# EAGLE design 14pole (EAGLE 8.3.2)
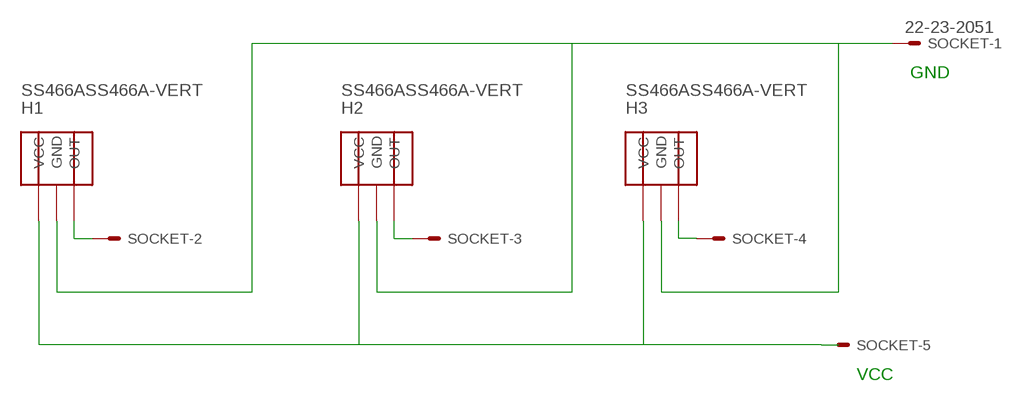
[diagram p0: schematic, sheet 1]

## Parts
H1  SS466ASS466A-VERT  [SS466A]
H2  SS466ASS466A-VERT  [SS466A]
H3  SS466ASS466A-VERT  [SS466A]
SOCKET  22-23-2051  [22-23-2051]

## Nets
N$1: H1.GND H2.GND H3.GND SOCKET.1
N$2: H1.VCC H2.VCC H3.VCC SOCKET.5
N$5: H3.OUT SOCKET.4
N$6: H2.OUT SOCKET.3
N$7: H1.OUT SOCKET.2

## Notes on the sheet
- GND
- VCC

## Library data of the parts
H1-H3 = SS466A:SS466A; SS466A: 0
SOCKET = con-molex:22-23-2051: .100" (2.54mm) Center Header - 5 Pin; MF: MOLEX; MPN: 22-23-2051; OC_FARNELL: 1462952; OC_NEWARK: 38C9178

## Net classes
0 default: width 0.762 mm

## Board
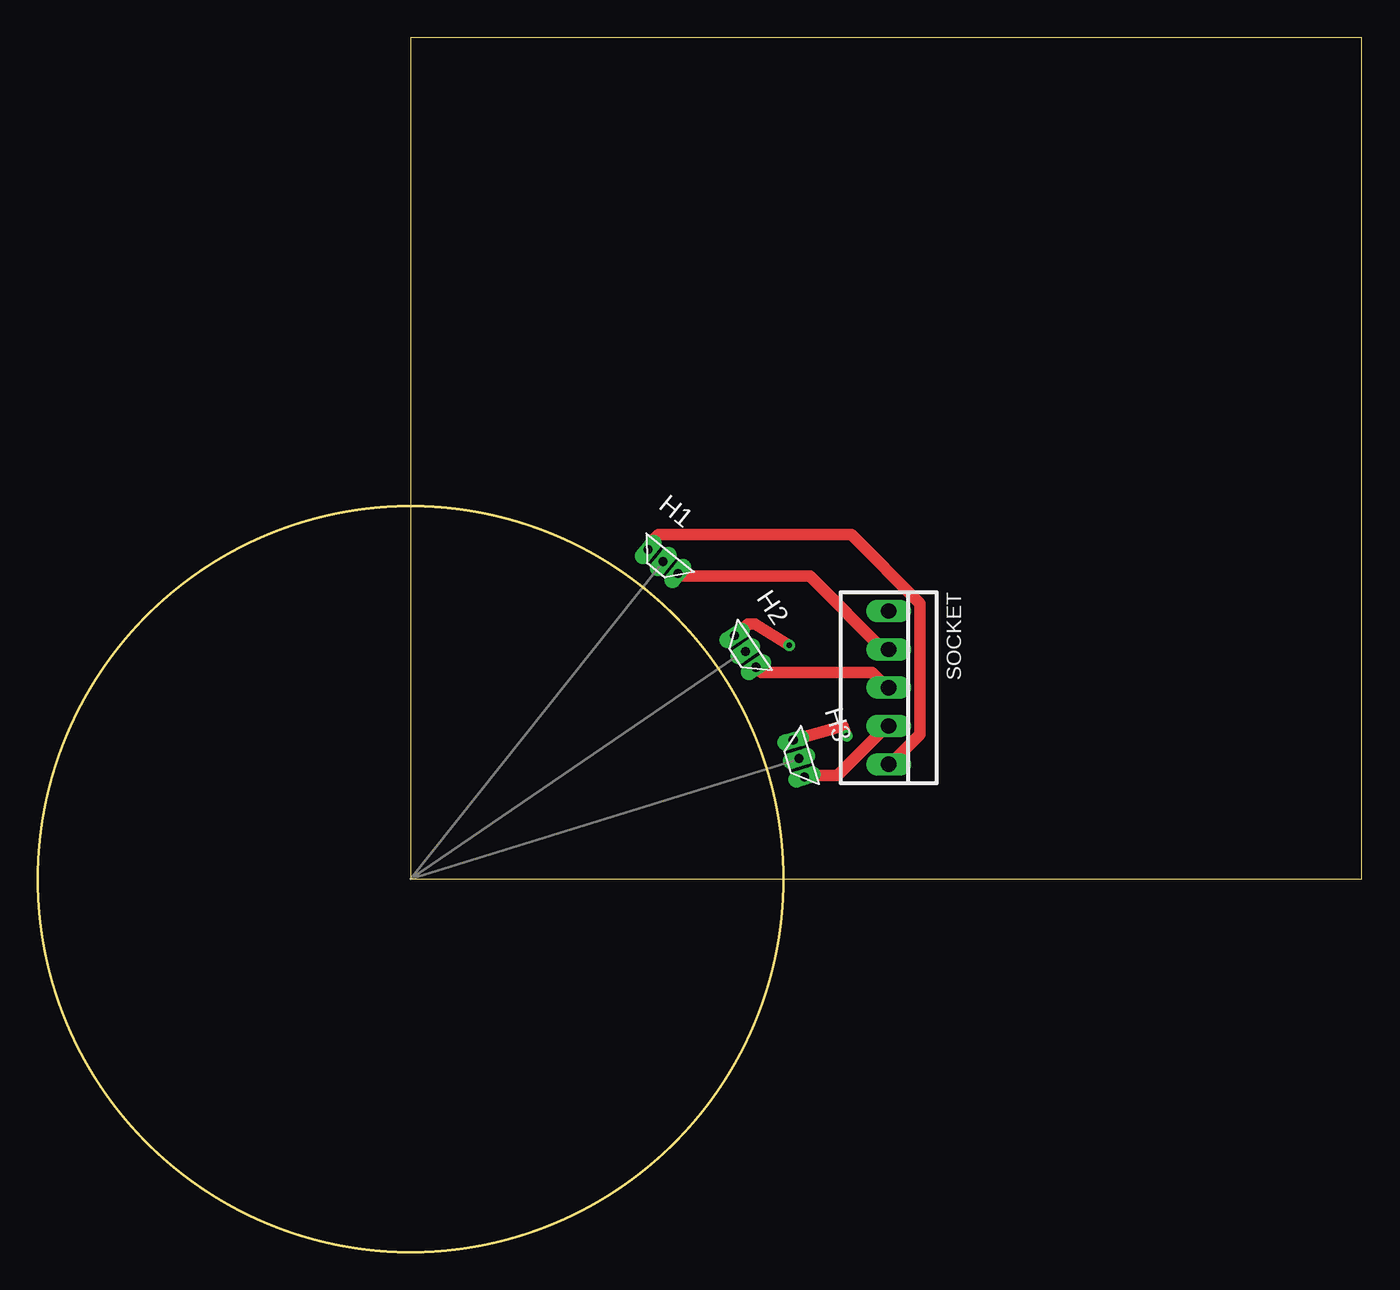
[diagram p1: board, top side]
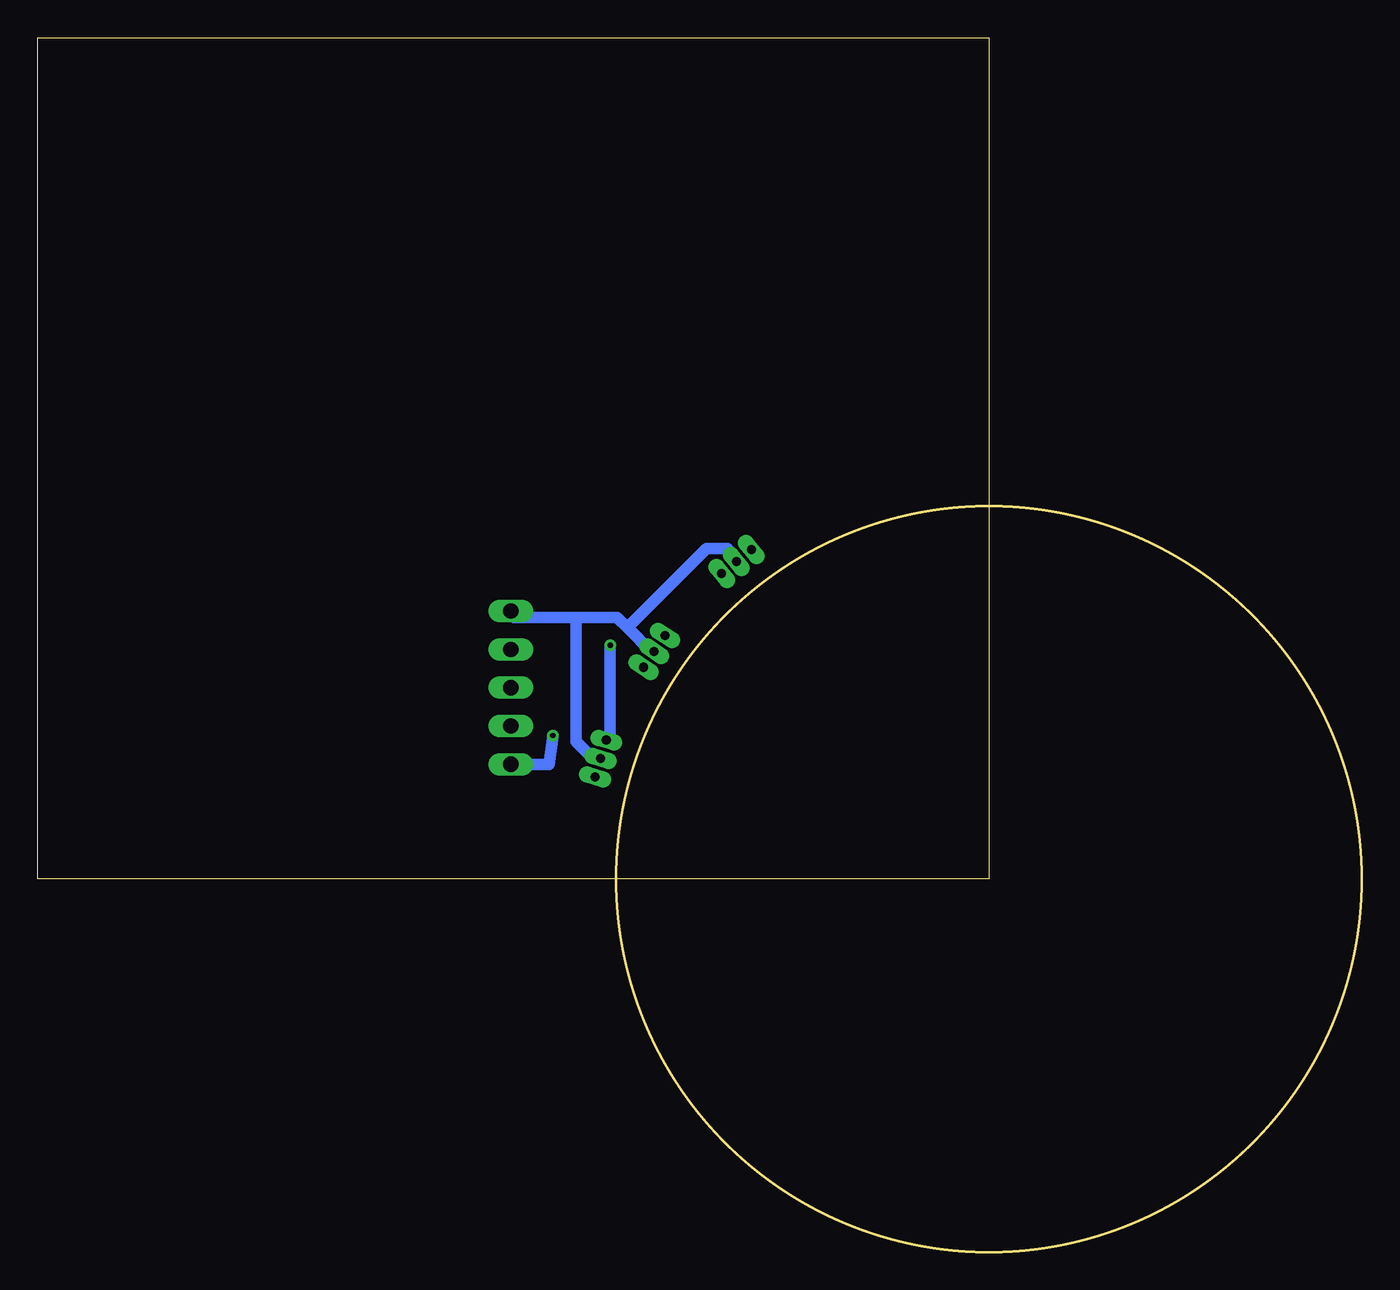
[diagram p2: board, bottom side, seen from below]

Size 87.94 x 80.63 mm. Coordinates in mm from the lower left corner, seen from the top.
Outline: 24.77,24.77 87.94,24.77 87.94,80.63 24.77,80.63 24.77,24.77
Outline: circle at 24.77,24.77 radius 24.77
Copper layers (1*16): Top 0.035mm / dielectric 1.5mm / Bottom 0.035mm
Design rules "default": minimum track width 6mil, minimum drill 0.35mm, track to track 6mil, track to pad 6mil, pad to pad 6mil, via to via 6mil, smd to smd 6mil, copper to edge 40mil, drill to drill 6mil, minimum pad ring 10mil, minimum via ring 8mil, stop-mask expansion 4mil, vias tented up to drill 0mil, thermal gap 10mil

### Footprints (pad centres in the part's own frame; a part is rotated, then mirrored left to right if it is on the bottom)
SS466A = drill 0.6 pad 0.813 long: GND 0,0; OUT 1.27,0; VCC -1.27,0
22-23-2051 = drill 1 long: 1 -5.08,0; 2 -2.54,0; 3 0,0; 4 2.54,0; 5 5.08,0

### Placement (x,y rotation side)
H1  41.53,45.85 321 top
H2  46.99,39.88 304 top
H3  50.55,32.77 287 top
SOCKET  56.52,37.47 270 top

### Tracks (layer width: path | path; a pad name or v marks a point on that pad's centre or on a via)
N$1
  Bottom 0.762: 48.77,41.45 49.45,42.14 52.2,42.14 | 48.77,41.45 47.17,39.85 H2.GND | 52.2,42.14 56.31,42.14 SOCKET.1 | 48.77,41.45 43.51,46.71 42.14,46.71 41.68,46.25 H1.GND | 52.2,42.14 52.2,33.91 51.28,33 50.83,33 H3.GND
N$2  (via drill 0.35)
  Top 0.762: v49.91,40.28 47.62,41.68 47.17,41.68 46.71,41.22 H2.VCC | H1.VCC 40.77,46.71 40.77,47.17 41.22,47.62 54.03,47.62 58.6,43.05 58.6,34.37 56.77,32.54 SOCKET.5 | H3.VCC 53.47,34.92 v53.72,34.29
  Bottom 0.762: v49.91,40.28 49.91,34.37 H3.VCC | v53.72,34.29 53.98,32.38 SOCKET.5
N$5
  Top 0.762: H3.OUT 51.28,31.62 53.11,31.62 56.31,34.82 SOCKET.4
N$6
  Top 0.762: H2.OUT 48.08,38.48 55.4,38.48 56.31,37.57 SOCKET.3
N$7
  Top 0.762: H1.OUT 42.6,44.88 51.28,44.88 56.31,39.85 SOCKET.2